# EasyEDA schematic SCH_STM32F103VE_Board_2024-08-16.json
TITLE: STM32F103VE V1.0; REV: 1.0; Date: 2017-06-02; Sheet: 1/1; Drawn By: jixin003
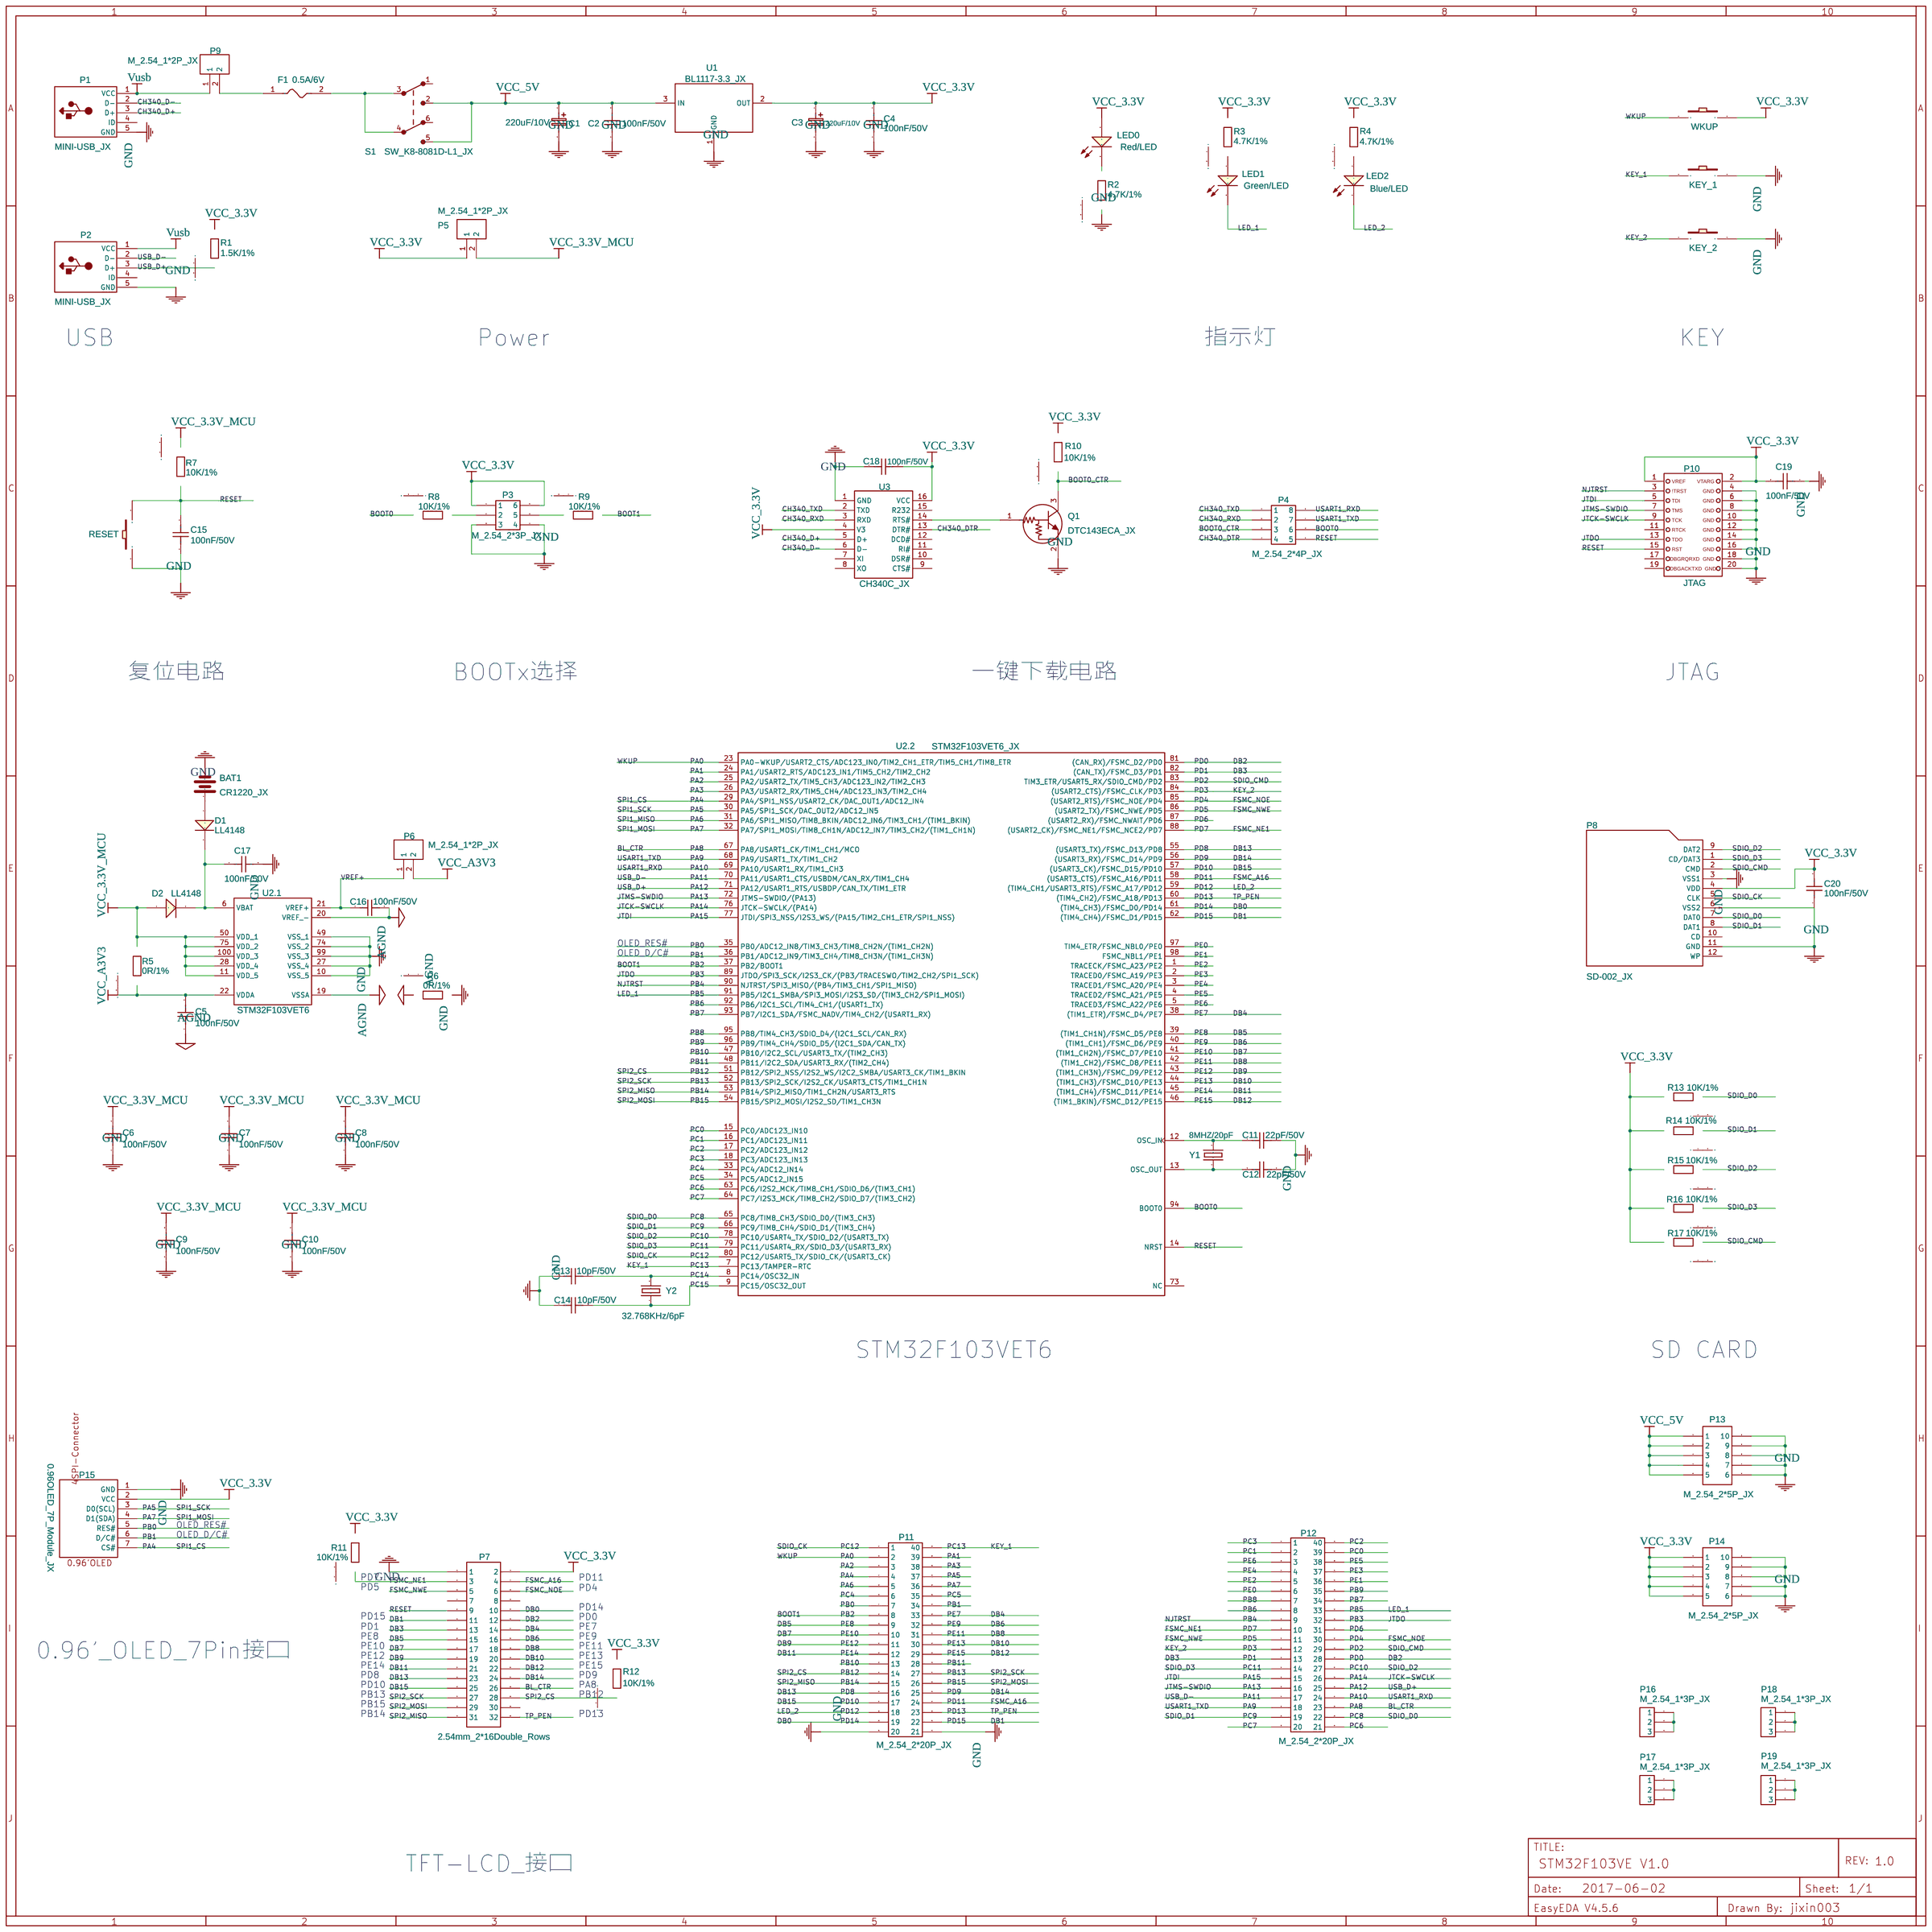
[diagram p0: schematic sheet]

## Parts
BAT1  CR1220_JX  [CR1220_JX]
C1  220uF/10V  [6.3X5.4_JX]
C2  100nF/50V  [0603_C_JX]
C3  220uF/10V  [6.3X5.4_JX]
C4  100nF/50V  [0603_C_JX]
C5  100nF/50V  [0603_C_JX]
C6  100nF/50V  [0603_C_JX]
C7  100nF/50V  [0603_C_JX]
C8  100nF/50V  [0603_C_JX]
C9  100nF/50V  [0603_C_JX]
C10  100nF/50V  [0603_C_JX]
C11  22pF/50V  [0603_C_JX]
C12  22pF/50V  [0603_C_JX]
C13  10pF/50V  [0603_C_JX]
C14  10pF/50V  [0603_C_JX]
C15  100nF/50V  [0603_C_JX]
C16  100nF/50V  [0603_C_JX]
C17  100nF/50V  [0603_C_JX]
C18  100nF/50V  [0603_C_JX]
C19  100nF/50V  [0603_C_JX]
C20  100nF/50V  [0603_C_JX]
D1  LL4148  [LL-34_JX]
D2  LL4148  [LL-34_JX]
F1  0.5A/6V  [0805_L_JX]
KEY_1  K2-1101UT-B4SW-01_JX  [SW_PUSH_2P_6MM_H5MM_JX]
KEY_2  K2-1101UT-B4SW-01_JX  [SW_PUSH_2P_6MM_H5MM_JX]
LED0  Red/LED  [0603_D_JX]
LED1  Green/LED  [0603_D_JX]
LED2  Blue/LED  [0603_D_JX]
P1  MINI-USB_JX  [USB_MINI_B_FE_JX]
P2  MINI-USB_JX  [USB_MINI_B_FE_JX]
P3  M_2.54_2*3P_JX  [M_2.54_2*3P_JX]
P4  M_2.54_2*4P_JX  [M_2.54_2*4P_JX]
P5  M_2.54_1*2P_JX  [M_2.54_1*2P_JX]
P6  M_2.54_1*2P_JX  [M_2.54_1*2P_JX]
P7  2.54mm_2*16Double_Rows  [2.54-2*16P_FE_JX]
P8  SD-002_JX  [SD-002_JX]
P9  M_2.54_1*2P_JX  [M_2.54_1*2P_JX]
P10  JTAG  [IDC_HEADER_STRAIGHT_20P_JX]
P11  M_2.54_2*20P_JX  [M_2.54_2*20P_JX]
P12  M_2.54_2*20P_JX  [M_2.54_2*20P_JX]
P13  M_2.54_2*5P_JX  [M_2.54_2*5P_JX]
P14  M_2.54_2*5P_JX  [M_2.54_2*5P_JX]
P15  0.96OLED_7P_Module_JX  [0.96OLED_7P_MODULE_JX]
P16  M_2.54_1*3P_JX  [M_2.54_1*3P_JX]
P17  M_2.54_1*3P_JX  [M_2.54_1*3P_JX]
P18  M_2.54_1*3P_JX  [M_2.54_1*3P_JX]
P19  M_2.54_1*3P_JX  [M_2.54_1*3P_JX]
Q1  DTC143ECA_JX  [SOT23_JX]
R1  1.5K/1%  [0603_R_JX]
R2  4.7K/1%  [0603_R_JX]
R3  4.7K/1%  [0603_R_JX]
R4  4.7K/1%  [0603_R_JX]
R5  0R/1%  [0603_R_JX]
R6  0R/1%  [0603_R_JX]
R7  10K/1%  [0603_R_JX]
R8  10K/1%  [0603_R_JX]
R9  10K/1%  [0603_R_JX]
R10  10K/1%  [0603_R_JX]
R11  10K/1%  [0603_R_JX]
R12  10K/1%  [0603_R_JX]
R13  10K/1%  [0603_R_JX]
R14  10K/1%  [0603_R_JX]
R15  10K/1%  [0603_R_JX]
R16  10K/1%  [0603_R_JX]
R17  10K/1%  [0603_R_JX]
RESET  K2-1101UT-B4SW-01_JX  [SW_PUSH_2P_6MM_H5MM_JX]
S1  SW_K8-8081D-L1_JX  [SW_K8-8081D-L1_JX]
U1  BL1117-3.3_JX  [SOT223_JX]
U2  STM32F103VET6  [LQFP100_14X14X05P_JX]  (sections 1,2)
U3  CH340C_JX  [SOP16_150MIL_JX]
U5  LOGO_EASYEDA-BOTTOM  [LOGO_EASYEDA-BOTTOM]
WKUP  K2-1101UT-B4SW-01_JX  [SW_PUSH_2P_6MM_H5MM_JX]
Y1  8MHZ/20pF  [HC-49S_JX]
Y2  32.768KHz/6pF  [SMD-3215_2P_JX]

## Library data of the parts
BAT1 D1 D2 F1 KEY_1 KEY_2 LED0-LED2 P3-P7 P9 P11-P14 P16-P19 Q1 RESET U1 U3 WKUP = -: Supplier: LCSC; Supplier Part: undefined
C1-C20 = Capacitor: Supplier: LCSC; Supplier Part: undefined
P1 P2 P8 P10 U2 Y1 Y2 = -: catid: 20; Supplier: LCSC; Supplier Part: undefined
P15 = -: Contributor: jixin002; Supplier: 技小新; Supplier Part: undefined
R1-R17 = Resistor: Supplier: LCSC; Supplier Part: undefined
S1 = -: sourceId: LXR9rJ0Uc; Supplier: LCSC; Supplier Part: undefined
U5 = -: Manufacturer Part: EASYEDA; Contributor: EasyEDA

## Nets
AGND: C5.1 C16.2 R6.1 U2.19(VSSA) U2.20(VREF -)
GND: BAT1.2 C1.2 C2.1 C3.2 C4.1 C6.1 C7.1 C8.1 C9.1 C10.1 C11.2 C12.2 C13.2 C14.1 C15.1 C17.2 C18.1 C19.1 C20.1 KEY_1.2 KEY_2.2 P1.5(GND) P2.5(GND) P3.3 P3.4 P7.1 P8.3(VSS1) P8.6(VSS2) P8.11(GND) P10.4 P10.6 P10.8 P10.10 P10.12 P10.14 P10.16 P10.18 P10.20 P11.20 P11.21 P13.6 P13.7 P13.8 P13.9 P13.10 P14.6 P14.7 P14.8 P14.9 P14.10 P15.1(GND) Q1.2(E) R2.1 R6.2 RESET.1 U1.1(GND) U2.10(VSS_5) U2.27(VSS_4) U2.49(VSS_1) U2.74(VSS_2) U2.99(VSS_3) U3.1(GND)
VCC_3.3V: C3.1 C4.2 C18.2 C19.2 C20.2 LED0.1(A) P3.1 P3.6 P5.1 P7.2 P8.4(VDD) P10.1 P10.2 P14.1 P14.2 P14.3 P14.4 P14.5 P15.2(VCC) R1.2 R3.2 R4.2 R10.2 R11.2 R12.2 R13.2 R14.2 R15.2 R16.2 R17.2 U1.2(OUT) U3.4(V3) U3.16(VCC) WKUP.2
VCC_3.3V_MCU: C6.2 C7.2 C8.2 C9.2 C10.2 D2.1(A) P5.2 R5.2 R7.1 U2.11(VDD_5) U2.28(VDD_4) U2.50(VDD_1) U2.75(VDD_2) U2.100(VDD_3)
VCC_5V: C1.1 C2.2 P13.1 P13.2 P13.3 P13.4 P13.5 S1.2 S1.5 U1.3(IN)
VCC_A3V3: C5.2 P6.2 R5.1 U2.22(VDDA)
BL_CTR: P7.26 P12.23 U2.67(PA8/USART1_CK/TIM1_CH1/MCO)
BOOT0: P4.6 R8.1 U2.94(BOOT0)
BOOT0_CTR: P4.3 Q1.3(C) R10.1
BOOT1: P11.8 R9.2 U2.37(PB2/BOOT1)
CH340_D+: P1.3(D+) U3.5(D+)
CH340_D-: P1.2(D-) U3.6(D-)
CH340_DTR: P4.4 U3.13(DTR#)
CH340_RXD: P4.2 U3.3(RXD)
CH340_TXD: P4.1 U3.2(TXD)
DB0: P7.10 P11.19 U2.61((TIM4_CH3)/FSMC_D0/PD14)
DB1: P7.11 P11.22 U2.62((TIM4_CH4)/FSMC_D1/PD15)
DB2: P7.12 P12.28 U2.81((CAN_RX)/FSMC_D2/PD0)
DB3: P7.13 P12.13 U2.82((CAN_TX)/FSMC_D3/PD1)
DB4: P7.14 P11.33 U2.38((TIM1_ETR)/FSMC_D4/PE7)
DB5: P7.15 P11.9 U2.39((TIM1_CH1N)/FSMC_D5/PE8)
DB6: P7.16 P11.32 U2.40((TIM1_CH1)/FSMC_D6/PE9)
DB7: P7.17 P11.10 U2.41((TIM1_CH2N)/FSMC_D7/PE10)
DB8: P7.18 P11.31 U2.42((TIM1_CH2)/FSMC_D8/PE11)
DB9: P7.19 P11.11 U2.43((TIM1_CH3N)/FSMC_D9/PE12)
DB10: P7.20 P11.30 U2.44((TIM1_CH3)/FSMC_D10/PE13)
DB11: P7.21 P11.12 U2.45((TIM1_CH4)/FSMC_D11/PE14)
DB12: P7.22 P11.29 U2.46((TIM1_BKIN)/FSMC_D12/PE15)
DB13: P7.23 P11.16 U2.55((USART3_TX)/FSMC_D13/PD8)
DB14: P7.24 P11.25 U2.56((USART3_RX)/FSMC_D14/PD9)
DB15: P7.25 P11.17 U2.57((USART3_CK)/FSMC_D15/PD10)
FSMC_A16: P7.4 P11.24 U2.58((USART3_CTS)/FSMC_A16/PD11)
FSMC_NE1: P7.3 P12.10 R11.1 U2.88((USART2_CK)/FSMC_NE1/FSMC_NCE2/PD7)
FSMC_NOE: P7.6 P12.30 U2.85((USART2_RTS)/FSMC_NOE/PD4)
FSMC_NWE: P7.5 P12.11 U2.86((USART2_TX)/FSMC_NWE/PD5)
JTCK-SWCLK: P10.9 P12.26 U2.76(JTCK-SWCLK/(PA14))
JTDI: P10.5 P12.15 U2.77(JTDI/SPI3_NSS/I2S3_WS/(PA15/TIM2_CH1_ETR/SPI1_NSS))
JTDO: P10.13 P12.32 U2.89(JTDO/SPI3_SCK/I2S3_CK/(PB3/TRACESWO/TIM2_CH2/SPI1_SCK))
JTMS-SWDIO: P10.7 P12.16 U2.72(JTMS-SWDIO/(PA13))
KEY_1: KEY_1.1 P11.40 U2.7(PC13/TAMPER-RTC)
KEY_2: KEY_2.1 P12.12 U2.84((USART2_CTS)/FSMC_CLK/PD3)
LED_1: LED1.2(C) P12.33 U2.91(PB5/I2C1_SMBA/SPI3_MOSI/I2S3_SD/(TIM3_CH2/SPI1_MOSI))
LED_2: LED2.2(C) P11.18 U2.59((TIM4_CH1/USART3_RTS)/FSMC_A17/PD12)
NJTRST: P10.3 P12.9 U2.90(NJTRST/SPI3_MISO/(PB4/TIM3_CH1/SPI1_MISO))
PA0: P11.2 U2.23(PA0-WKUP/USART2_CTS/ADC123_IN0/TIM2_CH1_ETR/TIM5_CH1/TIM8_ETR) WKUP.1
PA1: P11.39 U2.24(PA1/USART2_RTS/ADC123_IN1/TIM5_CH2/TIM2_CH2)
PA2: P11.3 U2.25(PA2/USART2_TX/TIM5_CH3/ADC123_IN2/TIM2_CH3)
PA3: P11.38 U2.26(PA3/USART2_RX/TIM5_CH4/ADC123_IN3/TIM2_CH4)
PA4: P11.4 P15.7(CS#) U2.29(PA4/SPI1_NSS/USART2_CK/DAC_OUT1/ADC12_IN4)
PA5: P11.37 P15.3(D0(SCL)) U2.30(PA5/SPI1_SCK/DAC_OUT2/ADC12_IN5)
PA6: P11.5 U2.31(PA6/SPI1_MISO/TIM8_BKIN/ADC12_IN6/TIM3_CH1/(TIM1_BKIN))
PA7: P11.36 P15.4(D1(SDA)) U2.32(PA7/SPI1_MOSI/TIM8_CH1N/ADC12_IN7/TIM3_CH2/(TIM1_CH1N))
PA9: P4.7 P12.18 U2.68(PA9/USART1_TX/TIM1_CH2)
PA10: P4.8 P12.24 U2.69(PA10/USART1_RX/TIM1_CH3)
PA11: P2.2(D-) P12.17 U2.70(PA11/USART1_CTS/USBDM/CAN_RX/TIM1_CH4)
PA12: P2.3(D+) P12.25 R1.1 U2.71(PA12/USART1_RTS/USBDP/CAN_TX/TIM1_ETR)
PB0: P11.7 P15.5(RES#) U2.35(PB0/ADC12_IN8/TIM3_CH3/TIM8_CH2N/(TIM1_CH2N))
PB1: P11.34 P15.6(D/C#) U2.36(PB1/ADC12_IN9/TIM3_CH4/TIM8_CH3N/(TIM1_CH3N))
PB6: P12.8 U2.92(PB6/I2C1_SCL/TIM4_CH1/(USART1_TX))
PB7: P12.34 U2.93(PB7/I2C1_SDA/FSMC_NADV/TIM4_CH2/(USART1_RX))
PB8: P12.7 U2.95(PB8/TIM4_CH3/SDIO_D4/(I2C1_SCL/CAN_RX))
PB9: P12.35 U2.96(PB9/TIM4_CH4/SDIO_D5/(I2C1_SDA/CAN_TX))
PB10: P11.13 U2.47(PB10/I2C2_SCL/USART3_TX/(TIM2_CH3))
PB11: P11.28 U2.48(PB11/I2C2_SDA/USART3_RX/(TIM2_CH4))
PB12: P7.28 P11.14 R12.1 U2.51(PB12/SPI2_NSS/I2S2_WS/I2C2_SMBA/USART3_CK/TIM1_BKIN)
PB13: P7.27 P11.27 U2.52(PB13/SPI2_SCK/I2S2_CK/USART3_CTS/TIM1_CH1N)
PB14: P7.31 P11.15 U2.53(PB14/SPI2_MISO/TIM1_CH2N/USART3_RTS)
PB15: P7.29 P11.26 U2.54(PB15/SPI2_MOSI/I2S2_SD/TIM1_CH3N)
PC0: P12.39 U2.15(PC0/ADC123_IN10)
PC1: P12.2 U2.16(PC1/ADC123_IN11)
PC2: P12.40 U2.17(PC2/ADC123_IN12)
PC3: P12.1 U2.18(PC3/ADC123_IN13)
PC4: P11.6 U2.33(PC4/ADC12_IN14)
PC5: P11.35 U2.34(PC5/ADC12_IN15)
PC6: P12.21 U2.63(PC6/I2S2_MCK/TIM8_CH1/SDIO_D6/(TIM3_CH1))
PC7: P12.20 U2.64(PC7/I2S3_MCK/TIM8_CH2/SDIO_D7/(TIM3_CH2))
PC8: P8.7(DAT0) P12.22 R13.1 U2.65(PC8/TIM8_CH3/SDIO_D0/(TIM3_CH3))
PC9: P8.8(DAT1) P12.19 R14.1 U2.66(PC9/TIM8_CH4/SDIO_D1/(TIM3_CH4))
PC10: P8.9(DAT2) P12.27 R15.1 U2.78(PC10/USART4_TX/SDIO_D2/(USART3_TX))
PC11: P8.1(CD/DAT3) P12.14 R16.1 U2.79(PC11/USART4_RX/SDIO_D3/(USART3_RX))
PC12: P8.5(CLK) P11.1 U2.80(PC12/USART5_TX/SDIO_CK/(USART3_CK))
PC14: C13.1 U2.8(PC14/OSC32_IN) Y2.2
PC15: C14.2 U2.9(PC15/OSC32_OUT) Y2.1
PD2: P8.2(CMD) P12.29 R17.1 U2.83(TIM3_ETR/USART5_RX/SDIO_CMD/PD2)
PD6: P12.31 U2.87((USART2_RX)/FSMC_NWAIT/PD6)
PD13: P7.32 P11.23 U2.60((TIM4_CH2)/FSMC_A18/PD13)
PE0: P12.6 U2.97(TIM4_ETR/FSMC_NBL0/PE0)
PE1: P12.36 U2.98(FSMC_NBL1/PE1)
PE2: P12.5 U2.1(TRACECK/FSMC_A23/PE2)
PE3: P12.37 U2.2(TRACED0/FSMC_A19/PE3)
PE4: P12.4 U2.3(TRACED1/FSMC_A20/PE4)
PE5: P12.38 U2.4(TRACED2/FSMC_A21/PE5)
PE6: P12.3 U2.5(TRACED3/FSMC_A22/PE6)
RESET: C15.2 P4.5 P7.9 P10.15 R7.2 RESET.2 U2.14(NRST)
VREF+: C16.1 P6.1 U2.21(VREF+)
Vusb: P1.1(VCC) P2.1(VCC) P9.1
Net-(BAT1-1): BAT1.1 D1.1(A)
Net-(C11-1): C11.1 U2.12(OSC_IN) Y1.2
Net-(C12-1): C12.1 U2.13(OSC_OUT) Y1.1
Net-(C17-1): C17.1 D1.2(K) D2.2(K) U2.6(VBAT)
Net-(F1-1): F1.1 P9.2
Net-(F1-2): F1.2 S1.3 S1.4
Net-(LED0-2): LED0.2(C) R2.2
Net-(LED1-1): LED1.1(A) R3.1
Net-(LED2-1): LED2.1(A) R4.1
Net-(P3-2): P3.2 R8.2
Net-(P3-5): P3.5 R9.1
Net-(P16-1): P16.1 P16.2 P16.3
Net-(P17-1): P17.1 P17.2 P17.3
Net-(P18-1): P18.1 P18.2 P18.3
Net-(P19-1): P19.1 P19.2 P19.3
Net-(Q1-1): Q1.1(B) U3.14(RTS#)

Not connected (* = marked no-connect by the designer): P1 4(ID); P2 4(ID); P7 7 8 30; P8 10(CD) 12(WP); P10 11 17 19; S1 1 6; U2 73(NC); U3 7(XI) 8(XO) 9(CTS#) 10(DSR#) 11(RI#) 12(DCD#) 15(R232)

## Notes on the sheet
- USB
- Power
- 指示灯
- KEY
- 复位电路
- BOOTx选择
- 一键下载电路
- JTAG
- OLED_D/C#
- OLED_RES#
- STM32F103VET6
- SD CARD
- OLED_RES#
- OLED_D/C#
- PD7
- PD11
- PD5
- PD4
- PD15
- PD0
- PD14
- PD1
- PE7
- PE8
- PE9
- 0.96’_OLED_7Pin接口
- PE10
- PE11
- PE12
- PE13
- PD8
- PE14
- PD9
- PE15
- PD10
- PA8
- PB13
- PB12
- PB15
- PB14
- PD13
- TFT-LCD_接口
